# EAGLE design t10_adapter_board (EAGLE 6.1)
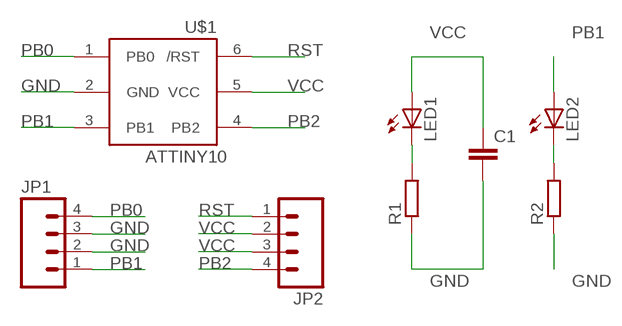
[diagram p0: schematic, sheet 1]

## Parts
C1  C-EUC0805K  [C0805K]
JP1  M04PTH  [1X04]
JP2  M04PTH  [1X04]
LED1  LEDCHIPLED_0805  [CHIPLED_0805]
LED2  LEDCHIPLED_0805  [CHIPLED_0805]
R1  R-EU_R0805  [R0805]
R2  R-EU_R0805  [R0805]
U$1  ATTINY10  [SOT23-6]

## Nets
GND: C1.2 JP1.2 JP1.3 R1.1 R2.1 U$1.2(GND)
N$1: LED1.C R1.2
N$4: LED2.C R2.2
PB0: JP1.4 U$1.1(PB0)
PB1: JP1.1 LED2.A U$1.3(PB1)
PB2: JP2.4 U$1.4(PB2)
RST: JP2.1 U$1.6(/RST)
VCC: C1.1 JP2.2 JP2.3 LED1.A U$1.5(VCC)

## Library data of the parts
C1 = rcl:C-EU: CAPACITOR, European symbol
JP1 JP2 = SparkFun-Connectors:M04: Header 4 Standard 4-pin 0.1" header. Use with straight break away headers (SKU : PRT-00116), right angle break away headers (PRT-00553), swiss pins (PRT-00743), machine pins (PRT-00117), and female headers (PRT-00115). Molex polarized connector foot print use with SKU : PRT-08231 with associated crimp pins and housings. 1MM SMD Version SKU: PRT-10208
LED1 LED2 = led:LED: LED OSRAM: - CHIPLED LG R971, LG N971, LY N971, LG Q971, LY Q971, LO R971, LY R971 LH N974, LH R974 LS Q976, LO Q976, LY Q976 LO Q996 - Hyper CHIPLED LW Q18S LB Q993, LB Q99A, LB R99A - SideLED LS A670, LO A670, LY A670, LG A670, LP A670 LB A673, LV A673, LT A673, LW A673 LH A674 LY A675 LS A676, LA A676, LO A676, LY A676, LW A676 LS A679, LY A679, LG A679 - Hyper Micro SIDELED® LS Y876, LA Y876, LO Y876, LY Y876 LT Y87S - SmartLED LW L88C, LW L88S LB L89C, LB L89S, LG L890 LS L89K, LO L89K, LY L89K LS L896, LA L896, LO L896, LY L896 - TOPLED LS T670, LO T670, LY T670, LG T670, LP T670 LSG T670, LSP T670, LSY T670, LOP T670, LYG T670 LG T671, LOG T671, LSG T671 LB T673, LV T673, LT T673, LW T673 LH T674 LS T676, LA T676, LO T676, LY T676, LB T676, LH T676, LSB T676, LW T676 LB T67C, LV T67C, LT T67C, LS T67K, LO T67K, LY T67K, LW E67C LS E67B, LA E67B, LO E67B, LY E67B, LB E67C, LV E67C, LT E67C LW T67C LS T679, LY T679, LG T679 LS T770, LO T770, LY T770, LG T770, LP T770 LB T773, LV T773, LT T773, LW T773 LH T774 LS E675, LA E675, LY E675, LS T675 LS T776, LA T776, LO T776, LY T776, LB T776 LHGB T686 LT T68C, LB T68C - Hyper Mini TOPLED® LB M676 - Mini TOPLED Santana® LG M470 LS M47K, LO M47K, LY M47K Source: http://www.osram.convergy.de LUXEON: - LUMILED® LXK2-PW12-R00, LXK2-PW12-S00, LXK2-PW14-U00, LXK2-PW14-V00 LXK2-PM12-R00, LXK2-PM12-S00, LXK2-PM14-U00 LXK2-PE12-Q00, LXK2-PE12-R00, LXK2-PE12-S00, LXK2-PE14-T00, LXK2-PE14-U00 LXK2-PB12-K00, LXK2-PB12-L00, LXK2-PB12-M00, LXK2-PB14-N00, LXK2-PB14-P00, LXK2-PB14-Q00 LXK2-PR12-L00, LXK2-PR12-M00, LXK2-PR14-Q00, LXK2-PR14-R00 LXK2-PD12-Q00, LXK2-PD12-R00, LXK2-PD12-S00 LXK2-PH12-R00, LXK2-PH12-S00 LXK2-PL12-P00, LXK2-PL12-Q00, LXK2-PL12-R00 Source: www.luxeon.com KINGBRIGHT: KA-3528ASYC Source: www.kingbright.com
R1 R2 = rcl:R-EU_: RESISTOR, European symbol
U$1 = adafruit_t10:ATTINY10: ATtiny4/5/9/10 8-bit Microcontroller with 512/1024 Bytes In-System Programmable Flash

## Board
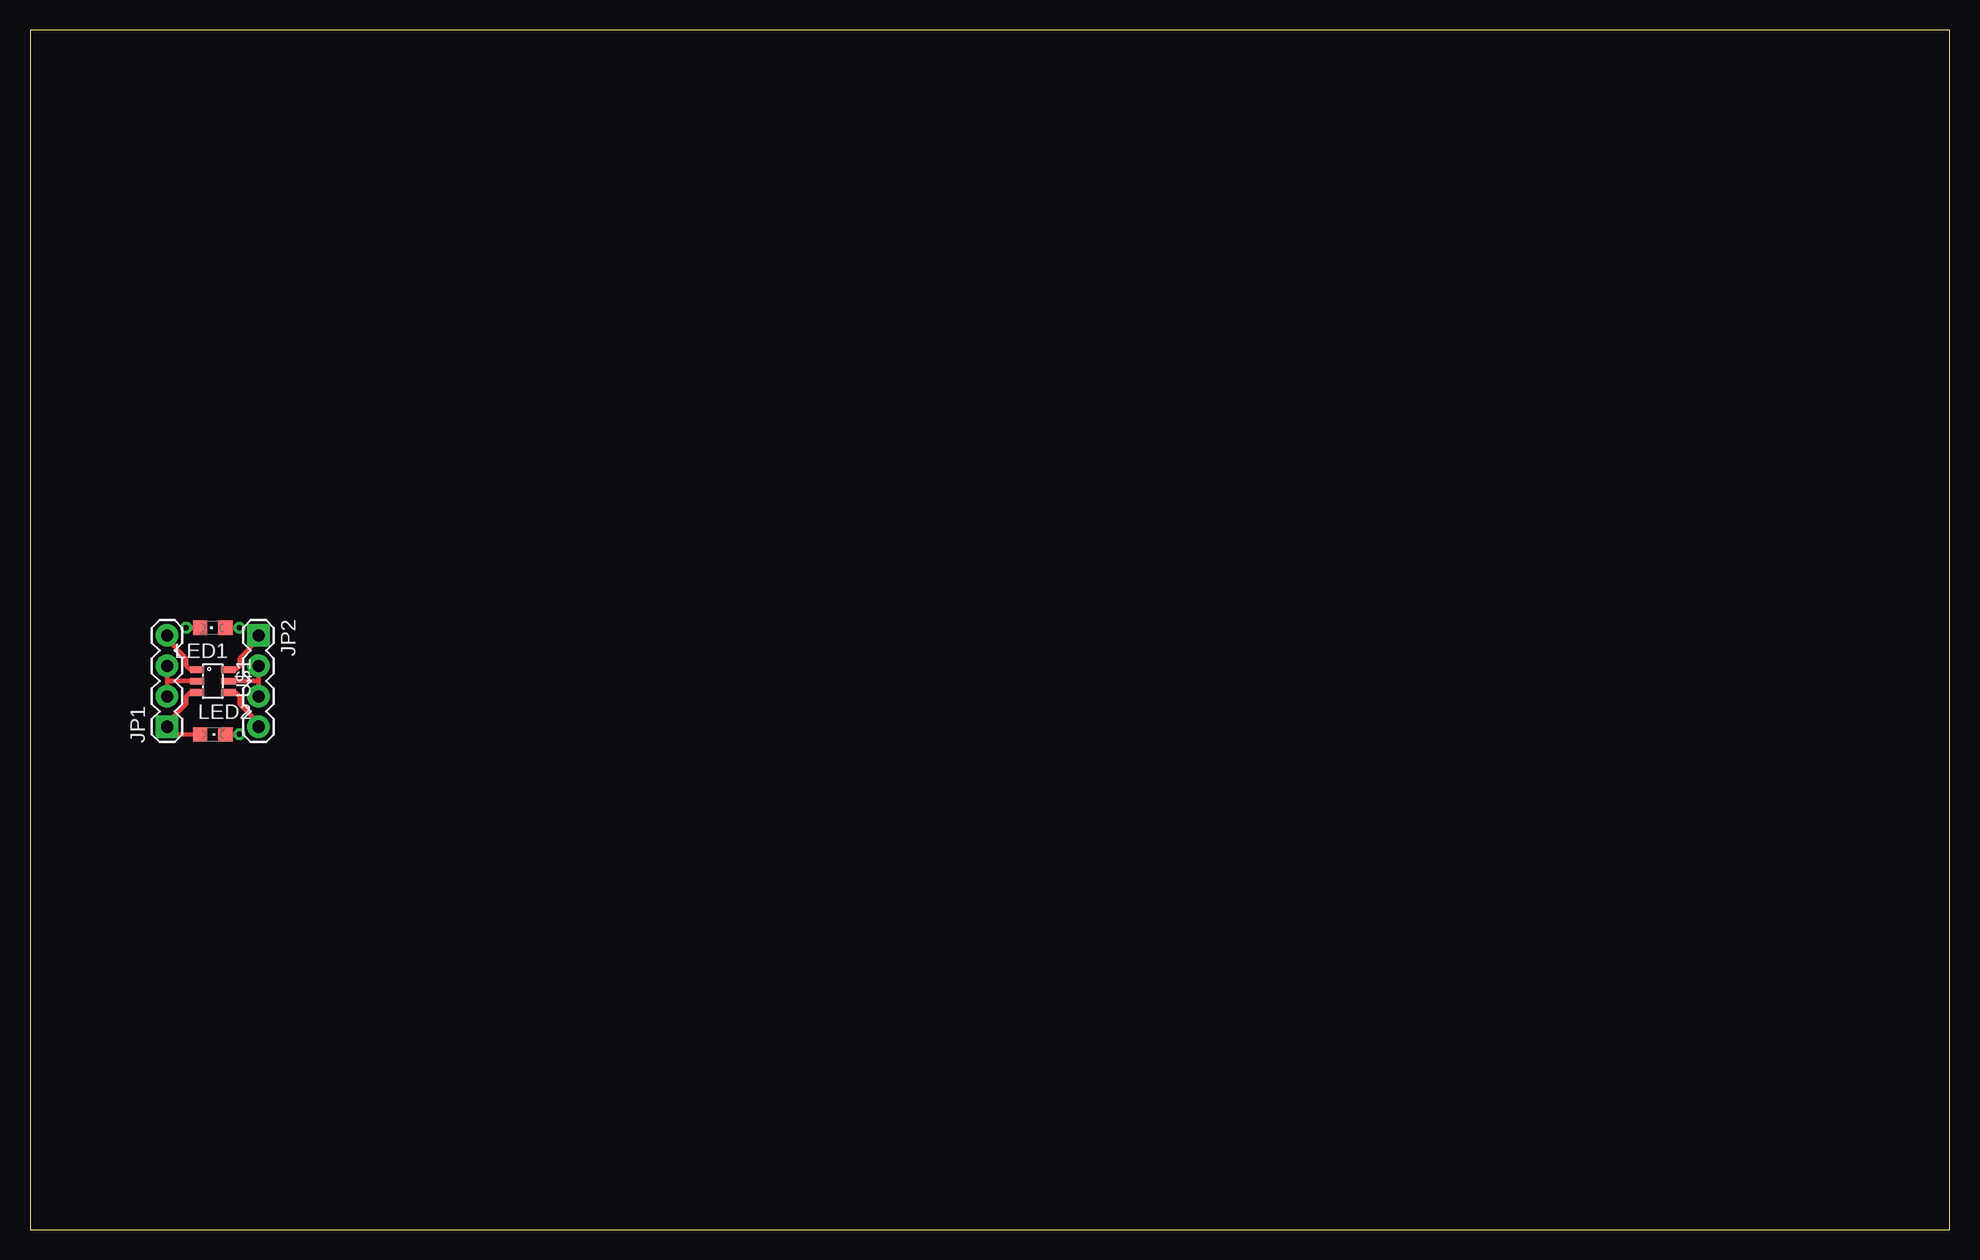
[diagram p1: board, top side]
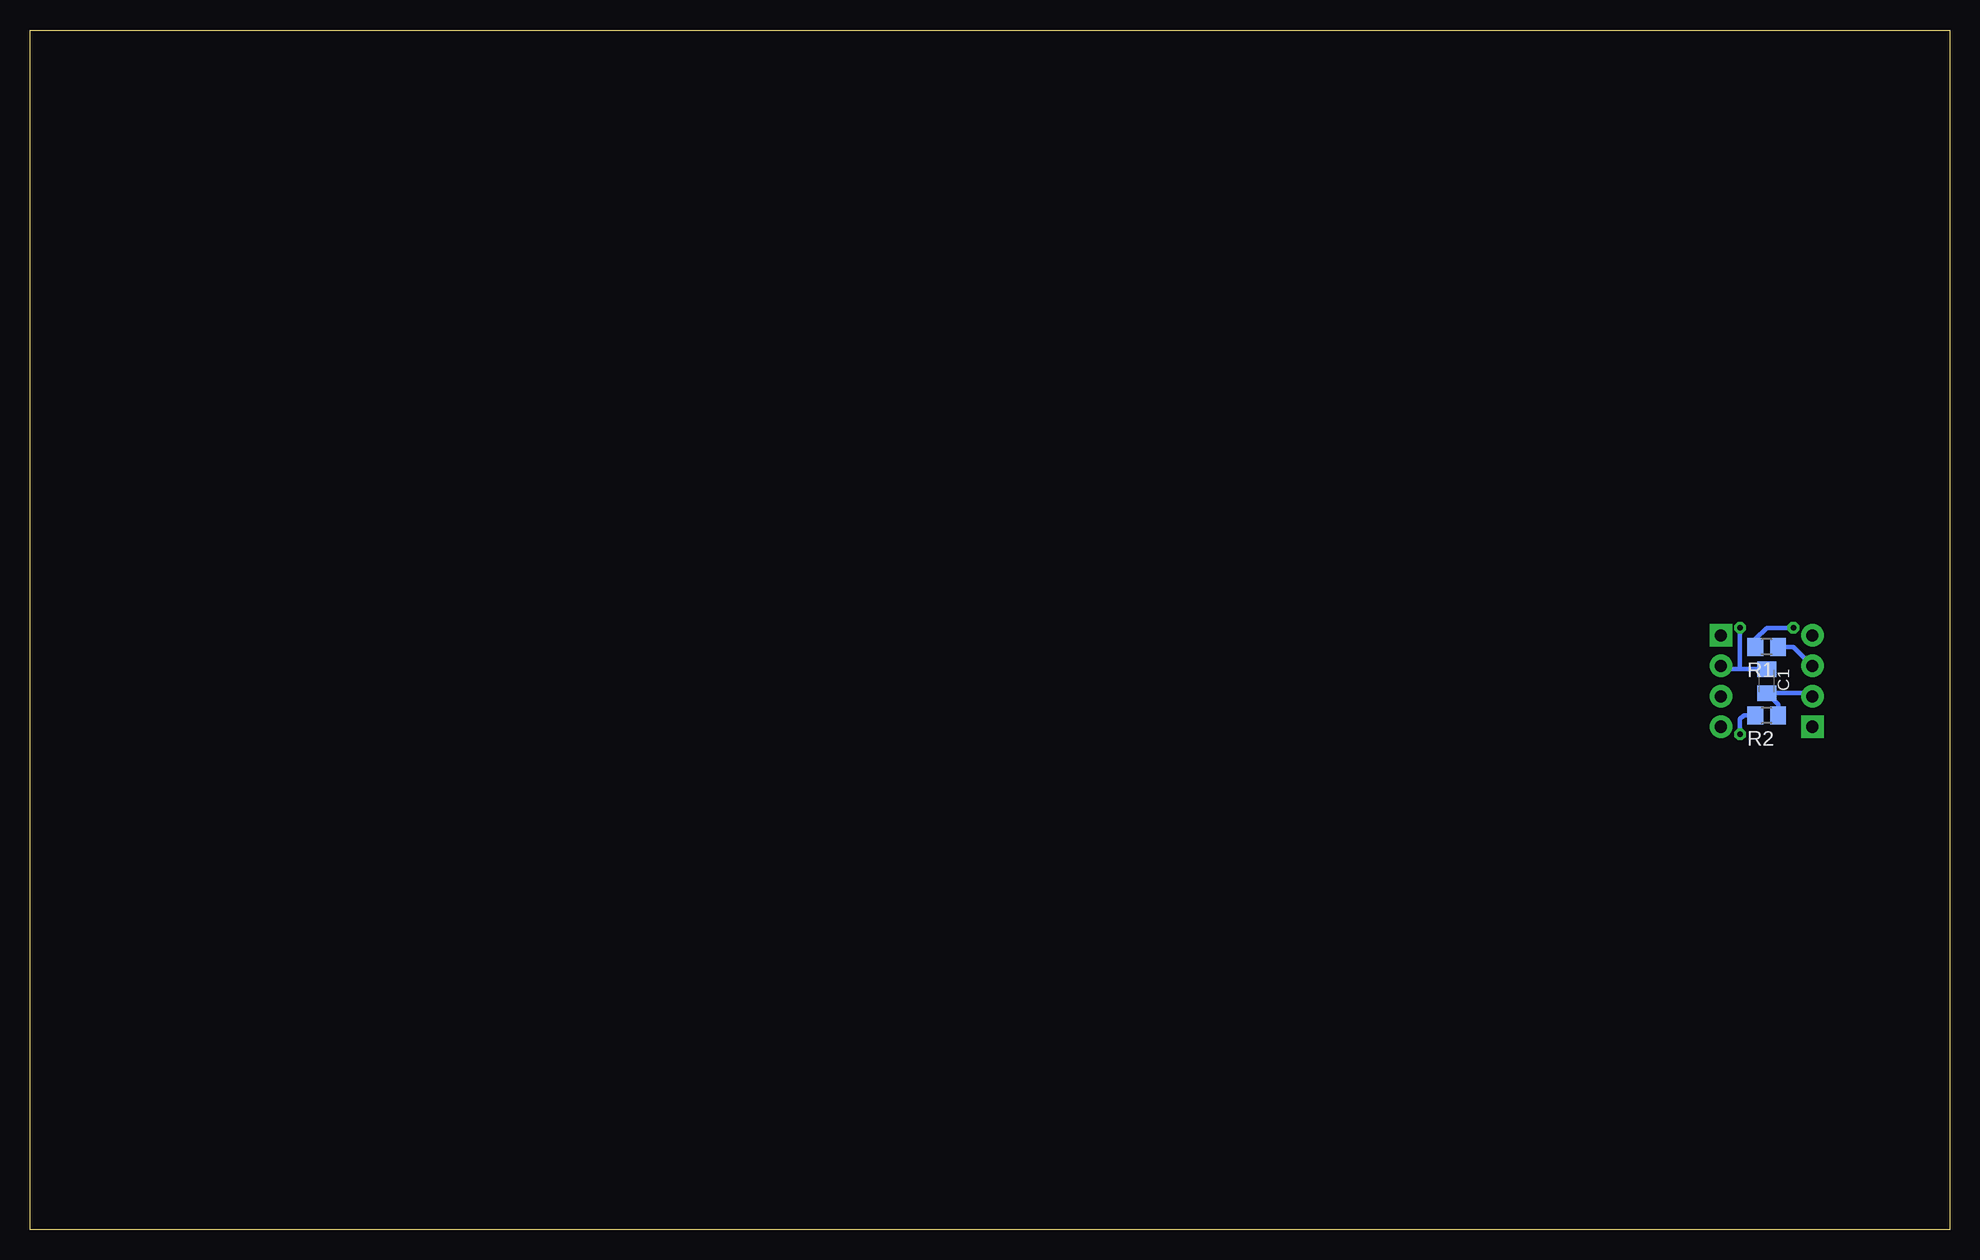
[diagram p2: board, bottom side, seen from below]

Size 160 x 100 mm. Coordinates in mm from the lower left corner, seen from the top.
Outline: 0,0 160,0 160,100 0,100 0,0
Copper layers (1*16): Top 0.035mm / dielectric 1.5mm / Bottom 0.035mm
Design rules: minimum track width 10mil, minimum drill 24mil, track to track 12mil, track to pad 12mil, pad to pad 12mil, via to via 12mil, smd to smd 10mil, copper to edge 12mil, drill to drill 12mil, minimum pad ring 10mil, minimum via ring 10mil, stop-mask expansion 4mil, vias tented up to drill 0mil, thermal gap 12mil

### Footprints (pad centres in the part's own frame; a part is rotated, then mirrored left to right if it is on the bottom)
C0805K = smd 1.3 x 1.6: 1 -1,0; 2 1,0
1X04 = drill 1.016 pad 1.88 square: 1 0,0 | drill 1.016 pad 1.88: 2 2.54,0; 3 5.08,0; 4 7.62,0
CHIPLED_0805 = smd 1.2 x 1.2: A 0,-1.05; C 0,1.05
R0805 = smd 1.3 x 1.5: 1 -0.95,0; 2 0.95,0
SOT23-6 = smd 0.55 x 1.2: 1 -0.95,-1.3; 2 0,-1.3; 3 0.95,-1.3; 4 0.95,1.3; 5 0,1.3; 6 -0.95,1.3

### Placement (x,y rotation side)
C1  15.24,45.72 270 bottom
JP1  11.43,41.91 90 top
JP2  19.05,49.53 270 top
LED1  15.24,50.16 90 top
LED2  15.24,41.27 270 top
R1  15.24,48.58 180 bottom
R2  15.24,42.86 180 bottom
U$1  15.24,45.72 270 top

### Tracks (layer width: path | path; a pad name or v marks a point on that pad's centre or on a via)
GND
  Top 0.356: JP1.3 11.43,45.72 | 11.43,45.72 JP1.2 | U$1.2 11.43,45.72
  Bottom 0.356: R2.1 14.29,43.77 C1.2 11.7,44.72 JP1.2 | R1.1 13.02,48.58 JP1.3
N$1  (via drill 0.46)
  Top 0.356: LED1.C v13.02,50.16
  Bottom 0.356: v13.02,50.16 15.24,50.16 16.19,49.21 R1.2
N$4  (via drill 0.46)
  Top 0.356: LED2.C v17.46,41.27
  Bottom 0.356: R2.2 17.14,42.86 17.46,42.55 v17.46,41.27
PB0
  Top 0.356: U$1.1 13.34,46.67 13.02,46.99 13.02,47.62 11.43,49.21 JP1.4
PB1
  Top 0.356: U$1.3 13.34,44.77 13.02,44.45 13.02,43.81 11.43,42.23 JP1.1 12.06,41.27 LED2.A
PB2
  Top 0.356: U$1.4 17.14,44.77 17.46,44.45 17.46,43.81 19.05,42.23 JP2.4
RST
  Top 0.356: U$1.6 17.14,46.67 17.46,46.99 17.46,47.62 19.05,49.21 JP2.1
VCC  (via drill 0.46)
  Top 0.356: U$1.5 19.05,45.72 | 19.05,45.72 JP2.2 | JP2.3 19.05,45.72 | LED1.A v17.46,50.16
  Bottom 0.356: C1.1 17.46,46.72 | 17.46,46.72 18.78,46.72 JP2.2 | v17.46,50.16 17.46,46.72